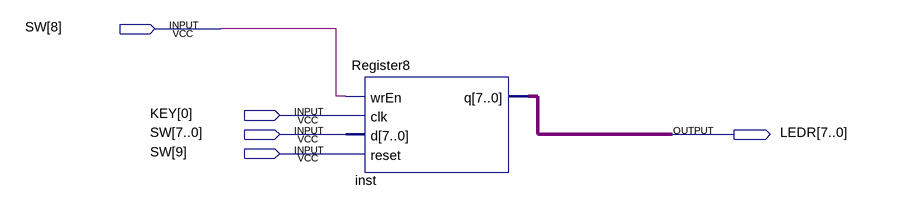
[diagram p0: schematic sheet]
// Quartus schematic Register_Demo.bdf as structural Verilog: 1 symbols, 5 pins
module Register_Demo (
  input  [9:0] SW,
  input  [0:0] KEY,
  output [7:0] LEDR
);

  Register8 inst (.wrEn(SW[8]), .clk(KEY[0]), .d(SW[7:0]), .reset(SW[9]), .q(LEDR));
endmodule
